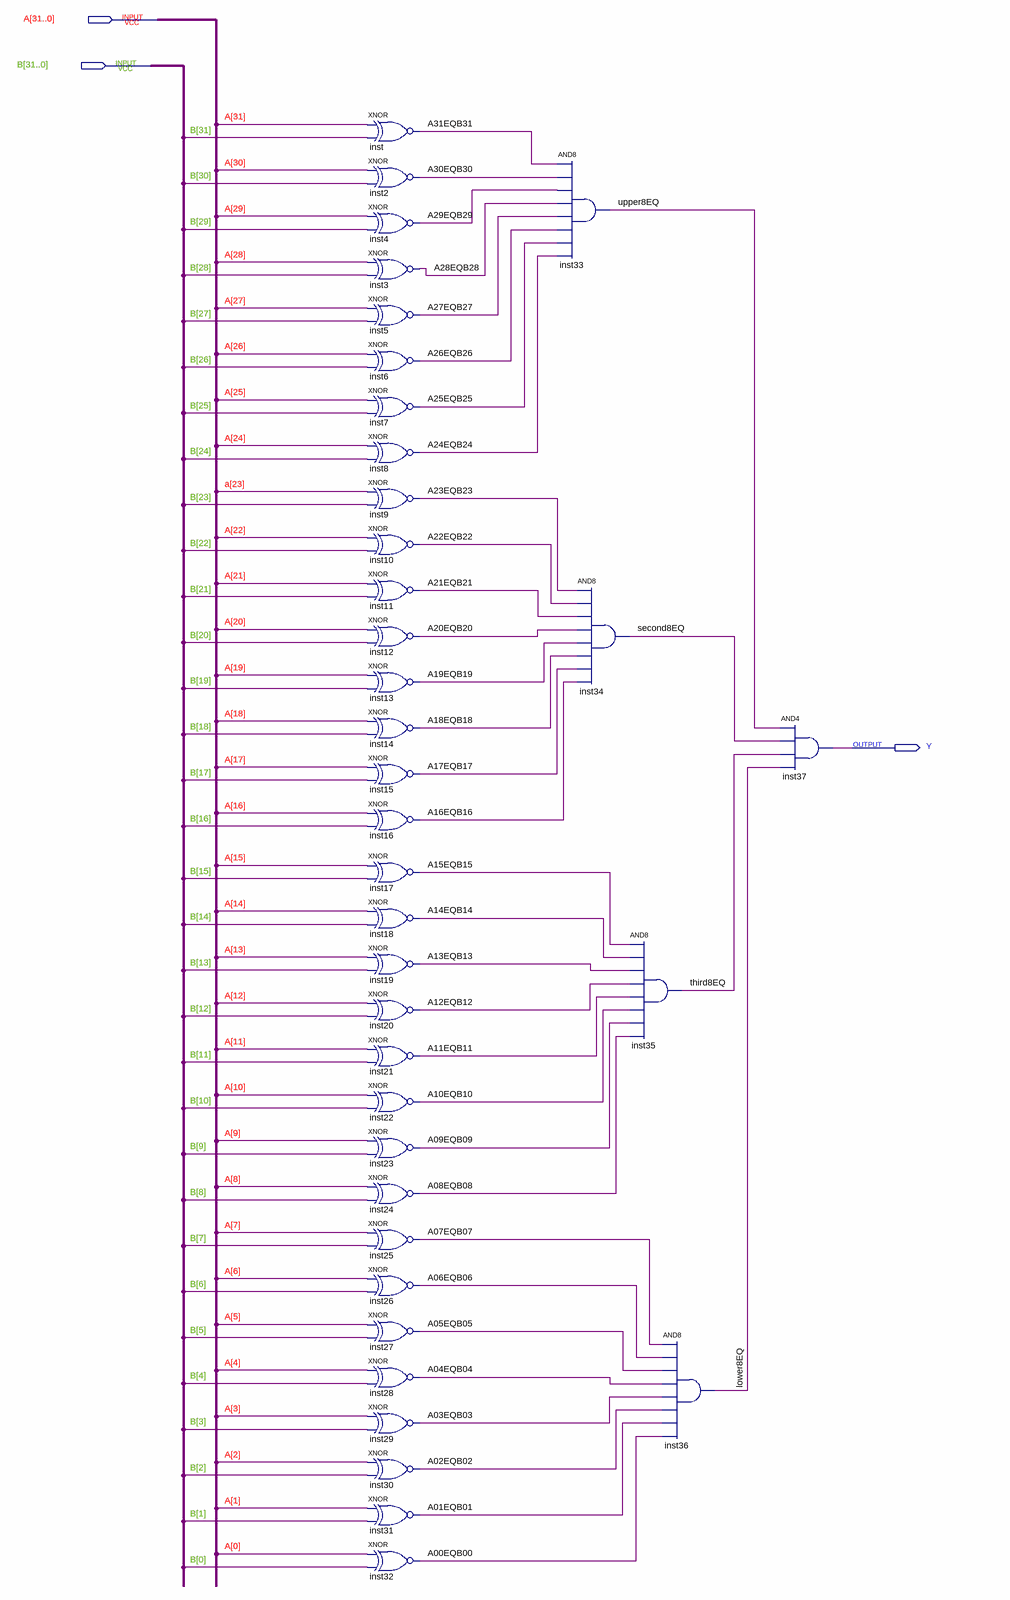
[diagram p0: schematic sheet]
// Quartus schematic EQ_32.bdf as structural Verilog: 37 symbols, 3 pins
module EQ_32 (
  input  [31:0] A,
  input  [31:0] B,
  output Y
);

  wire A00EQB00, A01EQB01, A02EQB02, A03EQB03, A04EQB04, A05EQB05, A06EQB06, A07EQB07, A08EQB08, A09EQB09,
       A10EQB10, A11EQB11, A12EQB12, A13EQB13, A14EQB14, A15EQB15, A16EQB16, A17EQB17, A18EQB18, A19EQB19,
       A20EQB20, A21EQB21, A22EQB22, A23EQB23, A24EQB24, A25EQB25, A26EQB26, A27EQB27, A28EQB28, A29EQB29,
       A30EQB30, A31EQB31, lower8EQ, second8EQ, third8EQ, upper8EQ;

  xnor inst (A31EQB31, A[31], B[31]);
  xnor inst2 (A30EQB30, A[30], B[30]);
  xnor inst4 (A29EQB29, A[29], B[29]);
  xnor inst3 (A28EQB28, A[28], B[28]);
  xnor inst5 (A27EQB27, A[27], B[27]);
  xnor inst6 (A26EQB26, A[26], B[26]);
  xnor inst7 (A25EQB25, A[25], B[25]);
  xnor inst8 (A24EQB24, A[24], B[24]);
  xnor inst9 (A23EQB23, A[23], B[23]);
  xnor inst10 (A22EQB22, A[22], B[22]);
  xnor inst11 (A21EQB21, A[21], B[21]);
  xnor inst12 (A20EQB20, A[20], B[20]);
  xnor inst13 (A19EQB19, A[19], B[19]);
  xnor inst14 (A18EQB18, A[18], B[18]);
  xnor inst15 (A17EQB17, A[17], B[17]);
  xnor inst16 (A16EQB16, A[16], B[16]);
  xnor inst17 (A15EQB15, A[15], B[15]);
  xnor inst18 (A14EQB14, A[14], B[14]);
  xnor inst19 (A13EQB13, A[13], B[13]);
  xnor inst20 (A12EQB12, A[12], B[12]);
  xnor inst21 (A11EQB11, A[11], B[11]);
  xnor inst22 (A10EQB10, A[10], B[10]);
  xnor inst23 (A09EQB09, A[9], B[9]);
  xnor inst24 (A08EQB08, A[8], B[8]);
  xnor inst25 (A07EQB07, A[7], B[7]);
  xnor inst26 (A06EQB06, A[6], B[6]);
  xnor inst27 (A05EQB05, A[5], B[5]);
  xnor inst28 (A04EQB04, A[4], B[4]);
  xnor inst29 (A03EQB03, A[3], B[3]);
  xnor inst30 (A02EQB02, A[2], B[2]);
  xnor inst31 (A01EQB01, A[1], B[1]);
  xnor inst32 (A00EQB00, A[0], B[0]);
  and inst33 (upper8EQ, A31EQB31, A30EQB30, A29EQB29, A28EQB28, A27EQB27, A26EQB26, A25EQB25, A24EQB24);
  and inst34 (second8EQ, A23EQB23, A22EQB22, A21EQB21, A20EQB20, A19EQB19, A18EQB18, A17EQB17, A16EQB16);
  and inst35 (third8EQ, A15EQB15, A14EQB14, A13EQB13, A12EQB12, A11EQB11, A10EQB10, A09EQB09, A08EQB08);
  and inst36 (lower8EQ, A07EQB07, A06EQB06, A05EQB05, A04EQB04, A03EQB03, A02EQB02, A01EQB01, A00EQB00);
  and inst37 (Y, upper8EQ, second8EQ, third8EQ, lower8EQ);
endmodule
